# Altium schematic sheet 780-00038 rev2, Pg1, SCH, Flex Pwr Sply.SchDoc
size B; PageSetup: Record=PageOptions|CenterHorizontal=True|CenterVertical=True|PrintScale=1.09|XCorrection=1.00|YCorrection=1.00|PrintKind=0|BorderSize=5000000|LeftOffset=0|BottomOffset=0|Orientation=2|PaperLength=1000|PaperWidth=1000|Scale=100|PaperSource=7|PrintQuality=-4|MediaType=1|DitherType=10|PaperKind=Tabloid 11 x 17in|PrintScaleMode=1
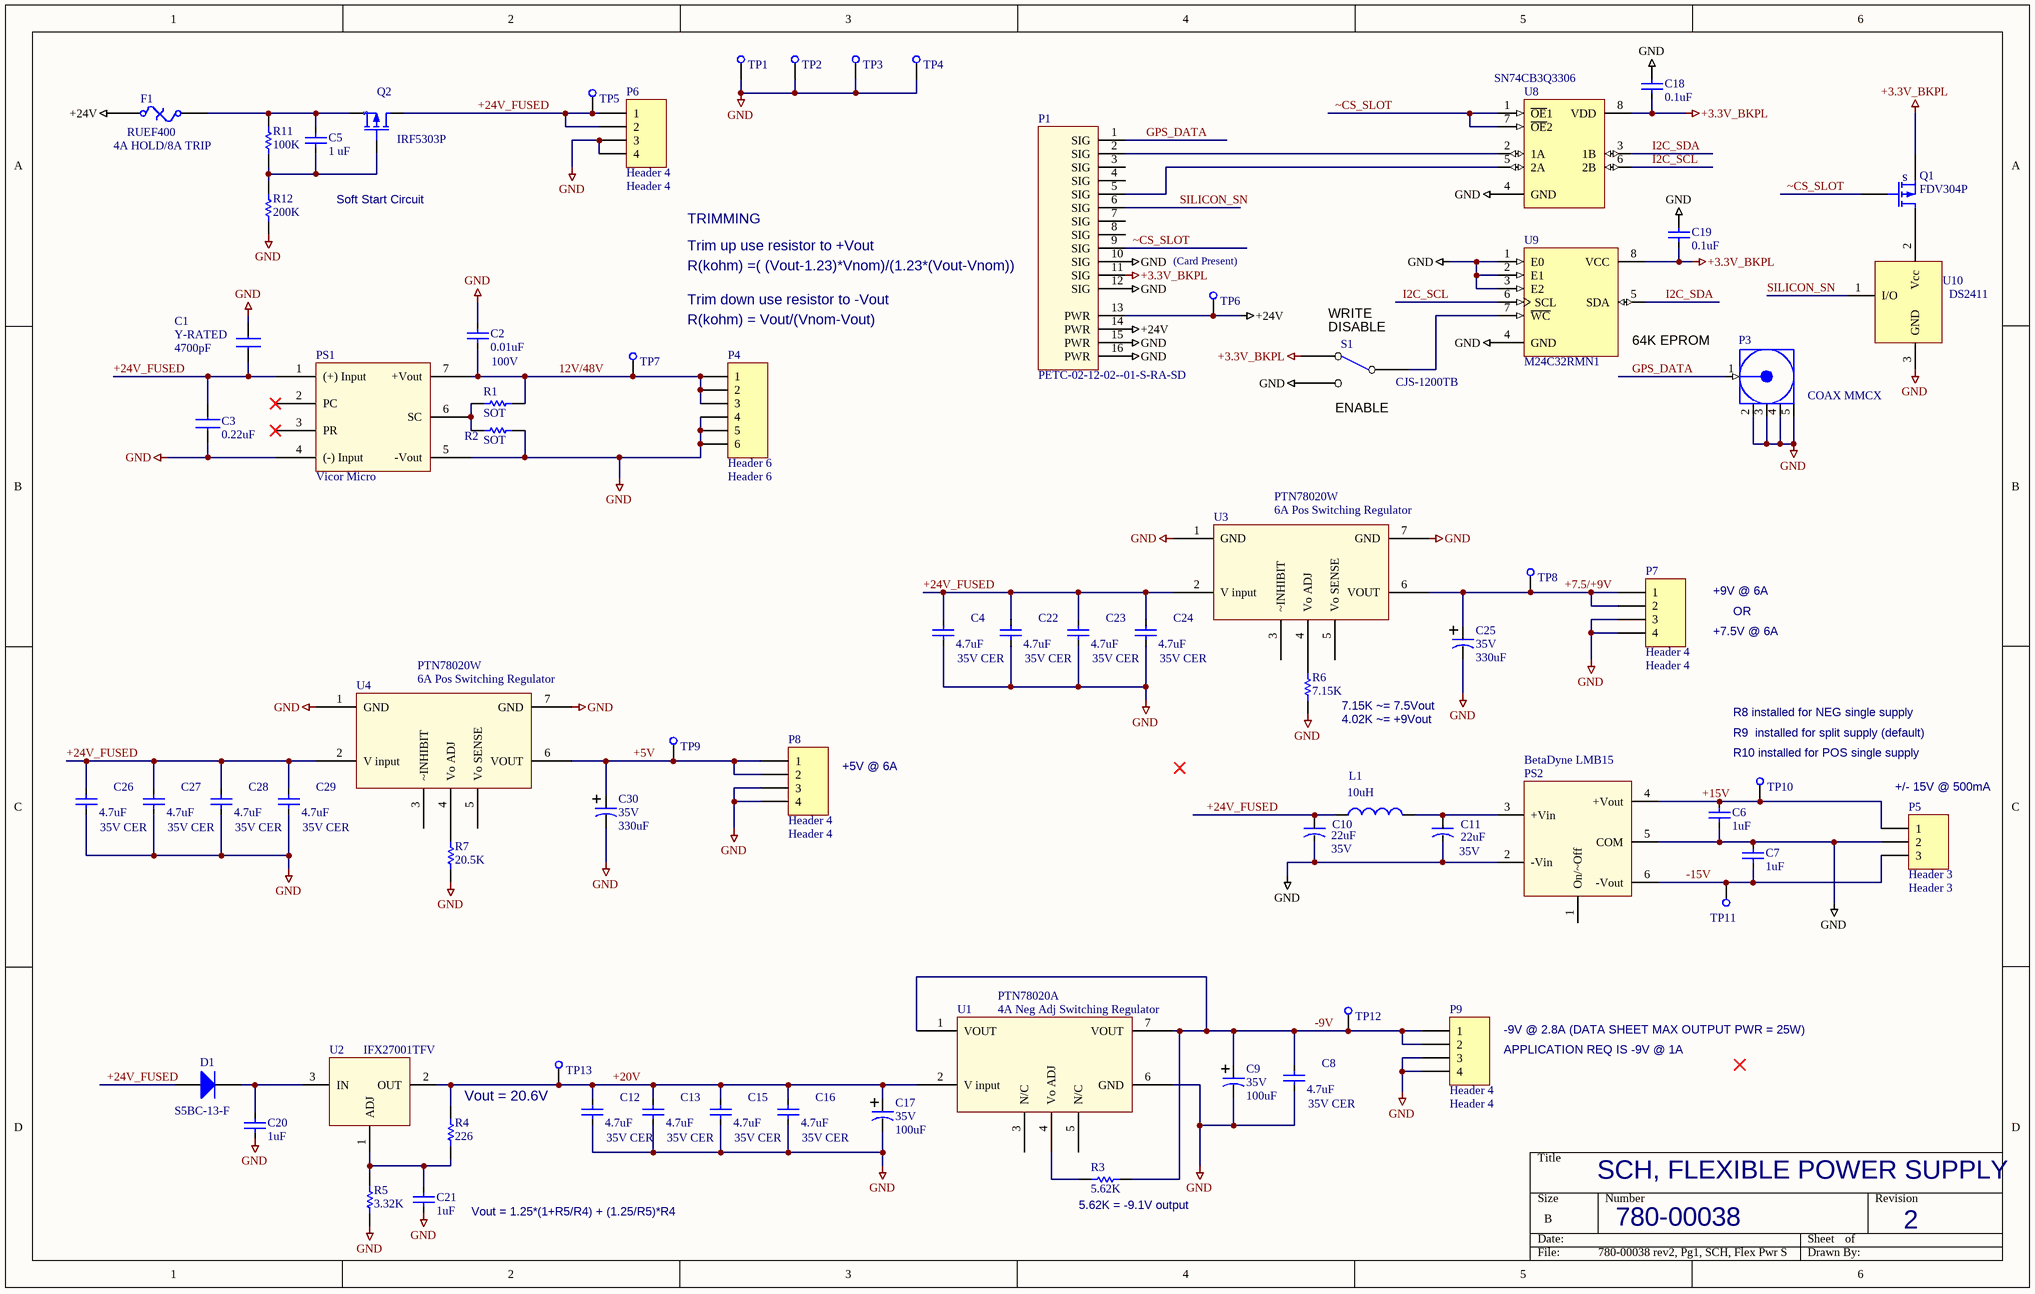
[diagram p0: 780-00038 rev2, Pg1, SCH, Flex Pwr Sply.SchDoc]

## Parts
C1  Y-RATED  value 4700pF  [1812]
C2  100V  value 0.01uF  [SMD_0805]
C3  0.22uF  [1812]
C4  35V CER  value 4.7uF  [SMD_0805]
C5  value 1 uF  [SMD_0805]  (hidden comment: Cap SMD)
C6  value 1uF  [SMD_0805]  (hidden comment: Cap SMD)
C7  value 1uF  [SMD_0805]  (hidden comment: Cap SMD)
C8  35V CER  value 4.7uF  [SMD_0805]
C9  35V  value 100uF  [CAP, Thru Hole 8mm dia]
C10  35V  value 22uF  [SMD_CAP_7343]
C11  35V  value 22uF  [SMD_CAP_7343]
C12  35V CER  value 4.7uF  [SMD_0805]
C13  35V CER  value 4.7uF  [SMD_0805]
C15  35V CER  value 4.7uF  [SMD_0805]
C16  35V CER  value 4.7uF  [SMD_0805]
C17  35V  value 100uF  [CAP, Thru Hole 8mm dia]
C18  value 0.1uF  [SMD_0805]  (hidden comment: Cap SMD)
C19  value 0.1uF  [SMD_0805]  (hidden comment: Cap SMD)
C20  value 1uF  [SMD_0805]  (hidden comment: Cap SMD)
C21  value 1uF  [SMD_0805]  (hidden comment: Cap SMD)
C22  35V CER  value 4.7uF  [SMD_0805]
C23  35V CER  value 4.7uF  [SMD_0805]
C24  35V CER  value 4.7uF  [SMD_0805]
C25  35V  value 330uF  [CAP, Thru Hole 10mm dia]
C26  35V CER  value 4.7uF  [SMD_0805]
C27  35V CER  value 4.7uF  [SMD_0805]
C28  35V CER  value 4.7uF  [SMD_0805]
C29  35V CER  value 4.7uF  [SMD_0805]
C30  35V  value 330uF  [CAP, Thru Hole 10mm dia]
D1  S5BC-13-F  [SMC]
F1  RUEF400  value 4A HOLD/8A TRIP  [PolySwitch Radial 0.2]
L1  value 10uH  [Inductor TDC SLF]  (hidden comment: 445-3869-1-ND)
P1  PETC-02-12-02--01-S-RA-SD  [PETC-02-12-02-01-RA]
P3  COAX MMCX  [MMCX2.54-V5]
P4  Header 6  [HDR1X6 for IDC]
P5  Header 3  [HDR1X3 for IDC]
P6  Header 4  [HDR1X4 for IDC]
P7  Header 4  [HDR1X4 for IDC]
P8  Header 4  [HDR1X4 for IDC]
P9  Header 4  [HDR1X4 for IDC]
PS1  Vicor Micro  [Vicor Micro SurfMate]
PS2  BetaDyne LMB15  [BetaDyne LNB15, DC/DC]
Q1  FDV304P  [SMD_SOT23_3]
Q2  IRF5303P  [TO-252(D-PAK)  PowerPAD]
R1  value SOT  [SMD_0805]  (hidden comment: Res 0805)
R2  value SOT  [SMD_0805]  (hidden comment: Res 0805)
R3  value 5.62K  [SMD_0805]  (hidden comment: Res 0805)
R4  value 226  [SMD_0805]  (hidden comment: Res 0805)
R5  value 3.32K  [SMD_0805]  (hidden comment: Res 0805)
R6  value 7.15K  [SMD_0805]  (hidden comment: Res 0805)
R7  value 20.5K  [SMD_0805]  (hidden comment: Res 0805)
R11  value 100K  [SMD_0805]  (hidden comment: Res 0805)
R12  value 200K  [SMD_0805]  (hidden comment: Res 0805)
S1  CJS-1200TB  [CAS-120B]
TP1  Test point  [PAD_80D_052H]  (value not drawn)
TP2  Test point  [PAD_80D_052H]  (value not drawn)
TP3  Test point  [PAD_80D_052H]  (value not drawn)
TP4  Test point  [PAD_80D_052H]  (value not drawn)
TP5  Test point  [PAD_80D_052H]  (value not drawn)
TP6  Test point  [PAD_80D_052H]  (value not drawn)
TP7  Test point  [PAD_80D_052H]  (value not drawn)
TP8  Test point  [PAD_80D_052H]  (value not drawn)
TP9  Test point  [PAD_80D_052H]  (value not drawn)
TP10  Test point  [PAD_80D_052H]  (value not drawn)
TP11  Test point  [PAD_80D_052H]  (value not drawn)
TP12  Test point  [PAD_80D_052H]  (value not drawn)
TP13  Test point  [PAD_80D_052H]  (value not drawn)
U1  4A Neg Adj Switching Regulator  value PTN78020A  [TEXAS Inst Switching Regulator]
U2  value IFX27001TFV  [TO-252(D-PAK)  PowerPAD]  (hidden comment: Voltage Reg, Adj)
U3  6A Pos Switching Regulator  value PTN78020W  [TEXAS Inst Switching Regulator]
U4  6A Pos Switching Regulator  value PTN78020W  [TEXAS Inst Switching Regulator]
U8  value SN74CB3Q3306  [PW008_N]  (hidden comment: SN74CBT3306PWLE)
U9  M24C32RMN1  [SOP8_N]
U10  DS2411  [SMD_SOT23_3]

## Nets
+3.3V_BKPL: C18.1 C19.1 P1.11(SIG) Q1.2(S) S1.3(NC) U8.8(VDD) U9.8(VCC)
+24V: F1.1 P1.13(PWR) P1.14(PWR) TP6.1(TP)
GND: C1.1 C2.2 C3.1 C4.1 C6.1 C7.2 C8.1 C9.2 C10.neg C11.neg C12.1 C13.1 C15.1 C16.1 C17.2 C18.2 C19.2 C20.1 C21.1 C22.1 C23.1 C24.1 C25.2 C26.1 C27.1 C28.1 C29.1 C30.2 P1.10(SIG) P1.12(SIG) P1.15(PWR) P1.16(PWR) P3.2(GND) P3.3(GND) P3.4(GND) P3.5(GND) P4.4 P4.5 P4.6 P5.2 P6.3 P6.4 P7.3 P7.4 P8.3 P8.4 P9.3 P9.4 PS1.4((-)_Input) PS1.5(-Vout) PS2.2(-Vin) PS2.5(COM) R2.2 R5.1 R6.1 R7.1 R12.1 S1.1(NO) TP1.1(TP) TP2.1(TP) TP3.1(TP) TP4.1(TP) U1.6(GND) U3.1(GND) U3.7(GND) U4.1(GND) U4.7(GND) U8.4(GND) U9.1(E0) U9.2(E1) U9.3(E2) U9.4(GND) U10.3(GND)
12V/48V: C2.1 P4.1 P4.2 P4.3 PS1.7(+Vout) R1.2 TP7.1(TP)
+5V: C30.1 P8.1 P8.2 TP9.1(TP) U4.6(VOUT)
+7.5/+9V: C25.1 P7.1 P7.2 TP8.1(TP) U3.6(VOUT)
+15V: C6.2 P5.1 PS2.4(+Vout) TP10.1(TP)
+20V: C12.2 C13.2 C15.2 C16.2 C17.1 R4.2 TP13.1(TP) U1.2(V_input) U2.2(OUT)
+24V_FUSED: C1.2 C3.2 C4.2 C10.pos C22.2 C23.2 C24.2 C26.2 C27.2 C28.2 C29.2 D1.1(A) L1.1 P6.1 P6.2 PS1.1((+)_Input) Q2.2(D) TP5.1(TP) U3.2(V_input) U4.2(V_input)
-9V: C8.2 C9.1 P9.1 P9.2 R3.2 TP12.1(TP) U1.1(VOUT) U1.7(VOUT)
-15V: C7.1 P5.3 PS2.6(-Vout) TP11.1(TP)
GPS_DATA: P1.1(SIG) P3.1(Signal)
I2C_SCL: U8.6(2B) U9.6(SCL)
I2C_SDA: U8.3(1B) U9.5(SDA)
SILICON_SN: P1.6(SIG) U10.1(I/O)
~CS_SLOT: P1.9(SIG) Q1.1(G) U8.1(~{OE}1) U8.7(~{OE}2)
NetC5_1: C5.1 Q2.1(G) R11.1 R12.2
NetC5_2: C5.2 F1.2 Q2.3(S) R11.2
NetC11_pos: C11.pos L1.2 PS2.3(+Vin)
NetC20_2: C20.2 D1.2(K) U2.3(IN)
NetC21_2: C21.2 R4.1 R5.2 U2.1(ADJ)
NetP1_2: P1.2(SIG) U8.2(1A)
NetP1_5: P1.5(SIG) U8.5(2A)
NetPS1_6: PS1.6(SC) R1.1 R2.1
NetQ1_3: Q1.3(D) U10.2(Vcc)
NetR3_1: R3.1 U1.4(Vo_ADJ)
NetR6_2: R6.2 U3.4(Vo_ADJ)
NetR7_2: R7.2 U4.4(Vo_ADJ)
NetS1_2: S1.2(COM) U9.7(~{WC})

Not connected (* = marked no-connect by the designer): P1 3(SIG) 4(SIG) 7(SIG) 8(SIG); PS1 2(PC)* 3(PR)*; PS2 1(On/~Off); U1 3(N/C) 5(N/C); U3 3(~INHIBIT) 5(Vo_SENSE); U4 3(~INHIBIT) 5(Vo_SENSE)

## Notes on the sheet
- Soft Start Circuit
- TRIMMING
- Trim up use resistor to +Vout
- R(kohm) =( (Vout-1.23)*Vnom)/(1.23*(Vout-Vnom))
- (near TP6) (Card Present)
- Trim down use resistor to -Vout
- R(kohm) = Vout/(Vnom-Vout)
- (near S1) WRITE
- (near S1) DISABLE
- (near U9) 64K EPROM
- (near S1) ENABLE
- +9V @ 6A
- +7.5V @ 6A
- OR
- +5V @ 6A
- (near R6) 7.15K ~= 7.5Vout
- (near R6) 4.02K ~= +9Vout
- R9  installed for split supply (default)
- R8 installed for NEG single supply
- (near TP10) R10 installed for POS single supply
- (near P5) +/- 15V @ 500mA
- -9V @ 2.8A (DATA SHEET MAX OUTPUT PWR = 25W)
- Vout = 20.6V
- APPLICATION REQ IS -9V @ 1A
- SCH, FLEXIBLE POWER SUPPLY
- Vout = 1.25*(1+R5/R4) + (1.25/R5)*R4
- (near R3) 5.62K = -9.1V output
- 780-00038
- 2
- (in symbol FDV304P) s
- (in symbol IRF5303P) s

## Library data of the parts
C1 = CAP NP_DOUG: Manufacturer: Murata; Manuf p/n: GA343DR7GD472KW01L; Vendor: DigiKey; Vendor p/n: 490-3493-1-ND; LCO p/n: 120-00049
C2 = Cap SMD: Capacitor; Manufacturer: Johanson; Manuf p/n: 101X15W103MV4E; Vendor: Digi-Key; Vendor p/n: 709-1325-1-ND; LCO p/n: 120-00050
C3 = CAP NP_DOUG: Manufacturer: TDK; Manuf p/n: C4532C0G1H224J; Vendor: DIGIKEY; Vendor Mult.: 10; Vendor p/n: 445-2709-1-ND; LCO p/n: 120-00030; COST: 4.95; Value: 0.22uF
C4 C8 C12 C13 C15 C16 C22-C24 C26-C29 = Cap SMD: Capacitor; LCO p/n: 120-00051
C5-C7 C20 C21 = Cap SMD: Capacitor; LCO p/n: 120-00006
C9 C17 = Cap Elec, 100 uF, 35V: Radial Thru hole; LCO p/n: 120-00052
C10 C11 = Cap Tant 35V: outline 6.0mm x 3.2mm; Manufacturer: Kemet; Manuf p/n: B45197A6226K409; Vendor: Digi-Key; Vendor p/n: 495-1582-1-ND; Vendor Mult.: 1; LCO p/n: 120-00046; COST: 1.32
C18 C19 = Cap SMD: Capacitor; Manufacturer: AVX; Manuf p/n: 08055C104KAT2A; Vendor: DigiKey; Vendor p/n: 478-1395-1-ND; Vendor Mult.: 10; LCO P/N: 120-00002; COST: 0.088
C25 C30 = Cap Elec, 330 uF, 35V: Radial Thru hole; LCO p/n: 120-00053
D1 = Diode: Default Diode; Manufacturer: Diodes Inc; Value: 5A / 100V; Vendor: DigiKey; Vendor Mult.: 1; Vendor p/n: S5BC-FDICT-ND; Description: RECTIFIER GPP SMD 100V 5A SMC; LCO p/n: 140-00012; COST: 0.47; Manuf p/n: S5BC-13-F
F1 = Fuse Thermal: PolySwitch RUE Series; Manufacturer: Tyco Electronics; Vendor: DIGIKEY; Vendor Mult.: 1; Vendor p/n: RUEF400-ND; LCO p/n: 145-00003; COST: 0.50; Manuf p/n: RUEF400
L1 = Inductor SMD 10uH 1.8A: Inductor; Manufacturer: TDK; Manuf p/n: SLF7045T-100M1R8-H; Vendor: Digi-Key; Vendor Mult.: 1; LCO p/n: 155-00015; Vendor p/n: 445-3869-1-ND
P1 = PETC-02-12-02--01-S-RA-SD: SAMTEC, SIGNAL(12)+PWR(4); LCO p/n: 125-00087; Vendor Mult.: 1; Manufacturer: SAMTEC; Manuf p/n: PETC-02-12-02--01-S-RA-SD; Vendor: SAMTEC; Vendor p/n: PETC-02-12-02--01-S-RA-SD
P3 = COAX-M: RF Coaxial PCB Connector, MMCX; Thru-Hole, Vertical Mount Plug,  50 Ohm Impedance; Manufacturer: Emerson; Manuf p/n: 135-3701-201; Vendor: DigiKey; Vendor p/n: J597-ND; VALUE: COAX-M; Vendor Mult.: 1; LCO p/n: 125-00054; COST: 5.24
P4 = Header 6: Header, 6-Pin; LCO p/n: 125-00033; VALUE: Header 6
P5 = Header 3, MTA100: Header, 4-Pin; LCO p/n: 125-00182; VALUE: Header 3
P6-P9 = Header 4: Header, 4-Pin; LCO p/n: 125-00037; VALUE: Header 4
PS1 = Vicor Micro: LCO p/n: 170-00007
PS2 = BetaDyne LMB15: DC/DC LMB15 15W, Dual Output; LCO p/n: 170-00002
Q1 = FDV304P: P-MOSFET LOGIC LEVEL; Manufacturer: Fairchild; Vendor: DigiKey; Vendor p/n: FDV304PCT-ND; Vendor Mult.: 1; LCO P/N: 195-00004; COST: 0.46; Manuf p/n: FDV304P; Value: FDV304P
Q2 = IRF5303P: P-Chan MOSFET; Manufacturer: INT'l Rectifier; Manuf p/n: IRFR5305TRPBF; LCO p/n: 150-00093; Vendor: Digi-Key; Vendor Mult.: 1; Vendor p/n: IRFR5305PBFCT-ND; VALUE: IRF5303P
R1 R2 = Res SMD: Resistor 0805; Manufacturer: Vishay/Dale; Manuf p/n: CRCW0805SOTFKEA; Vendor: DIGIKEY; Vendor p/n: 541-SOTCCT-ND; Vendor Mult.: 10; LCO p/n: 181-SOT; COST: 0.09
R3 = Res SMD: Resistor 0805; Manufacturer: Vishay/Dale; Manuf p/n: CRCW08055.62KFKEA; Vendor: DIGIKEY; Vendor p/n: 541-5.62KCCT-ND; Vendor Mult.: 10; LCO p/n: 181-05621; COST: 0.09
R4 = Res SMD: Resistor 0805; Manufacturer: Vishay/Dale; Manuf p/n: CRCW0805226FKEA; Vendor: DIGIKEY; Vendor p/n: 541-226CCT-ND; Vendor Mult.: 10; LCO p/n: 181-02260; COST: 0.09
R5 = Res SMD: Resistor 0805; Manufacturer: Vishay/Dale; Manuf p/n: CRCW08053.32KFKEA; Vendor: DIGIKEY; Vendor p/n: 541-3.32KCCT-ND; Vendor Mult.: 10; LCO p/n: 181-03321; COST: 0.09
R6 = Res SMD: Resistor 0805; Manufacturer: Vishay/Dale; Manuf p/n: CRCW08057.15KFKEA; Vendor: DIGIKEY; Vendor p/n: 541-7.15KCCT-ND; Vendor Mult.: 10; LCO p/n: 181-07151; COST: 0.09
R7 = Res SMD: Resistor 0805; Manufacturer: Vishay/Dale; Manuf p/n: CRCW080520.5KFKEA; Vendor: DIGIKEY; Vendor p/n: 541-20.5KCCT-ND; Vendor Mult.: 10; LCO p/n: 181-02052; COST: 0.09
R11 = Res SMD: Resistor 0805; Manufacturer: Vishay/Dale; Manuf p/n: CRCW0805100KFKEA; Vendor: DIGIKEY; Vendor p/n: 541-100KCCT-ND; Vendor Mult.: 10; LCO p/n: 181-01003; COST: 0.09
R12 = Res SMD: Resistor 0805; Manufacturer: Vishay/Dale; Manuf p/n: CRCW0805200KFKEA; Vendor: DIGIKEY; Vendor p/n: 541-200KCCT-ND; Vendor Mult.: 10; LCO p/n: 181-02003; COST: 0.09
S1 = SW_SPDT_DOUG: Manufacturer: Copal Electronics; Manuf p/n: CAS-120TB; Vendor: DIGIKEY; Vendor Mult.: 1; LCO p/n: 185-00010; COST: 1.27; Value: SW_SPDT
TP1-TP13 = Test point: Manufacturer: Keystone; Manuf p/n: 1249; Vendor: Bisco Ind.; LCO p/n: 125-00013; Vendor p/n: 1249; COST: 0.18; VALUE: Test point
U1 = PTN78020A: Neg Adj Switching Regulator; LCO p/n: 150-00089
U2 = Voltage Reg, Adjustable: IFX27001; Manufacturer: Infineon; LCO p/n: 150-00087; Vendor: Digi-Key; Vendor Mult.: 1; Vendor p/n: IFX27001TFVINTR-ND; COST: 0.61; Manuf p/n: IFX27001TFV
U3 U4 = PTN78020W: Pos Adj Switching Regulator; LCO p/n: 150-00088
U8 = SN74CBT3306PWLE: Dual FET Bus Switch; Manufacturer: TI; Manuf p/n: SN74CB3Q3306APWR; LCO p/n: 150-00083; Vendor: Digi-Key; Vendor Mult.: 1; Vendor p/n: 296-15102-1-ND; COST: 0.95
U9 = M24C32RMN1: 32 Kbit Serial I²C Bus EEPROM; LCO p/n: 150-00076
U10 = DS2411: Silicon Serial Number; Manufacturer: Dallas; Manuf p/n: DS2411P+; Vendor: DigiKey; Vendor p/n: DS2411P+-ND; Vendor Mult.: 1; LCO P/N: 150-00031; COST: 1.59; Value: DS2411